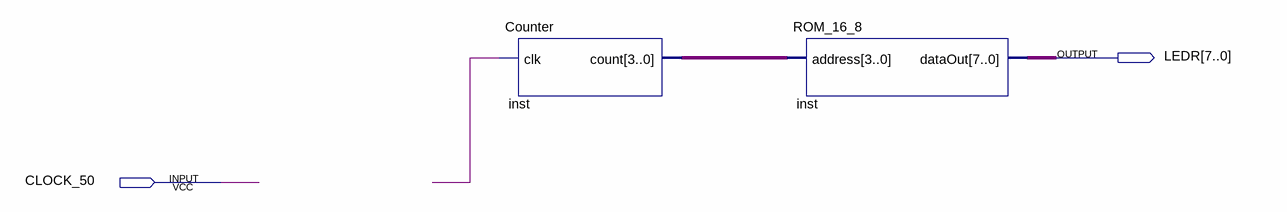
[diagram p0: schematic sheet]
// Quartus schematic ROM_Demo.bdf as structural Verilog: 2 symbols, 2 pins
module ROM_Demo (
  input  CLOCK_50,
  output [7:0] LEDR
);

  wire undriven;
  wire [3:0] inst_count;

  Counter inst (.clk(undriven), .count(inst_count));
  ROM_16_8 inst_dup2 (.address(inst_count), .dataOut(LEDR));
endmodule
